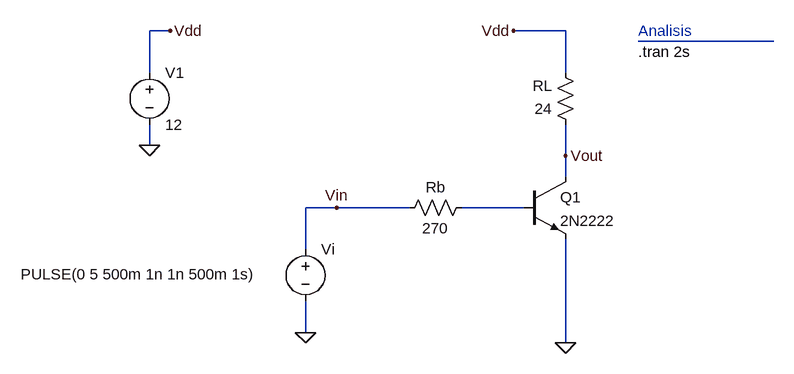
[diagram p0: schematic bjt_switch-ejemplo5.asc]
bjt_switch-ejemplo5.asc, the LTspice schematic file:
Version 4
SHEET 1 880 680
WIRE -528 -176 -560 -176
WIRE 80 -176 0 -176
WIRE 400 -160 192 -160
WIRE -560 -112 -560 -176
WIRE 80 -112 80 -176
WIRE -560 0 -560 -32
WIRE 80 16 80 -32
WIRE 80 48 80 16
WIRE -272 96 -320 96
WIRE -160 96 -272 96
WIRE 16 96 -80 96
WIRE -320 160 -320 96
WIRE -320 288 -320 240
WIRE 80 304 80 144
FLAG 80 304 0
FLAG -560 0 0
FLAG -528 -176 Vdd
FLAG -320 288 0
FLAG 0 -176 Vdd
FLAG 80 16 Vout
FLAG -272 96 Vin
SYMBOL npn 16 48 R0
SYMATTR InstName Q1
SYMATTR Value 2N2222
SYMBOL res -64 80 R90
WINDOW 0 0 56 VBottom 2
WINDOW 3 32 56 VTop 2
SYMATTR InstName Rb
SYMATTR Value 270
SYMBOL res 96 -16 R180
WINDOW 0 36 76 Left 2
WINDOW 3 36 40 Left 2
SYMATTR InstName RL
SYMATTR Value 24
SYMBOL voltage -560 -128 R0
WINDOW 123 0 0 Left 0
WINDOW 39 0 0 Left 0
SYMATTR InstName V1
SYMATTR Value 12
SYMBOL voltage -320 144 R0
WINDOW 3 -438 54 Left 2
WINDOW 123 0 0 Left 0
WINDOW 39 0 0 Left 0
SYMATTR InstName Vi
SYMATTR Value PULSE(0 5 500m 1n 1n 500m 1s)
TEXT 192 -144 Left 2 !.tran 2s
TEXT 192 -176 Left 2 ;Analisis

The netlist it stands for:
* bjt_switch-ejemplo5.asc
Q1 Vout N002 0 0 2N2222
Rb N002 Vin 270
RL Vout Vdd 24
V1 Vdd 0 12
Vi Vin 0 PULSE(0 5 500m 1n 1n 500m 1s)
.model NPN NPN
.model PNP PNP
.lib standard.bjt
.tran 2s
* Analisis
.backanno
.end